# Altium schematic sheet SHDN21-S02-V00-SegInterface.SchDoc
size A4
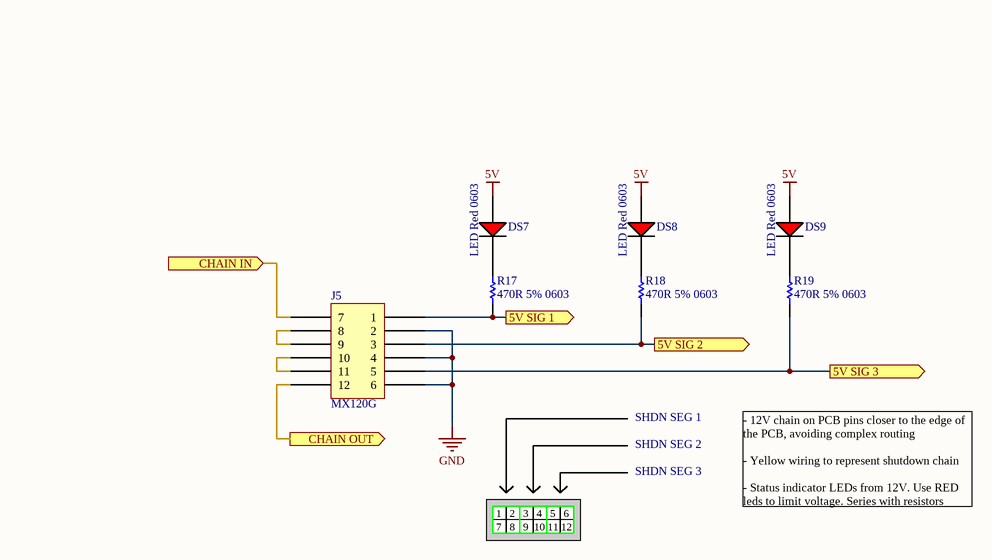
[diagram p0: SHDN21-S02-V00-SegInterface.SchDoc]

## Parts
DS7  LED Red 0603  [LED RED 0603]
DS8  LED Red 0603  [LED RED 0603]
DS9  LED Red 0603  [LED RED 0603]
J5  MX120G
R17  470R 5% 0603  [Res_ThinFilm_0603]
R18  470R 5% 0603  [Res_ThinFilm_0603]
R19  470R 5% 0603  [Res_ThinFilm_0603]

## Ports
5V SIG 1 (out), 5V SIG 2 (out), 5V SIG 3 (out), CHAIN IN (in), CHAIN OUT (out)

## Nets
5V: DS7.1(A) DS8.1(A) DS9.1(A)
GND: J5.2 J5.4 J5.6
5V SIG 1: J5.1 R17.1 ; port 5V SIG 1
5V SIG 2: J5.3 R18.1 ; port 5V SIG 2
5V SIG 3: J5.5 R19.1 ; port 5V SIG 3
CHAIN IN: J5.7 ; port CHAIN IN
CHAIN OUT: J5.12 ; port CHAIN OUT
NetDS7_2: DS7.2(C) R17.2
NetDS8_2: DS8.2(C) R18.2
NetDS9_2: DS9.2(C) R19.2
NetJ5_8: J5.8 J5.9
NetJ5_10: J5.10 J5.11

## Notes on the sheet
- SHDN SEG 1
- SHDN SEG 2
- 1
- 7
- 2
- 8
- 3
- 9
- 4
- 10
- 5
- 11
- 6
- 12
- SHDN SEG 3
- - 12V chain on PCB pins closer to the edge of the PCB, avoiding complex routing
  - Yellow wiring to represent shutdown chain
  - Status indicator LEDs from 12V. Use RED leds to limit voltage. Series with resistors

## Library data of the parts
J5 = MX120G: MX120G with standard connector layout
R17-R19 = 470R 5% 0603: Resistor, SMD, 470R, 0.1W, 5%, 0603